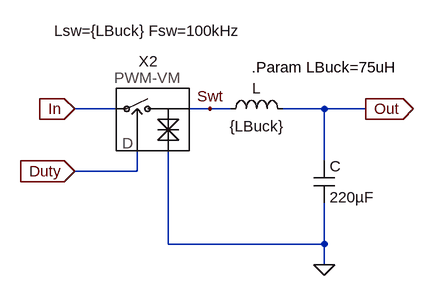
[diagram p0: schematic Buck-VM-Power_Train.asc]
Buck-VM-Power_Train.asc, the LTspice schematic file:
Version 4
SHEET 1 880 696
WIRE 80 48 16 48
WIRE 224 48 192 48
WIRE 256 48 224 48
WIRE 400 48 336 48
WIRE 464 48 400 48
WIRE 400 128 400 48
WIRE 112 144 112 112
WIRE 112 144 16 144
WIRE 160 256 160 112
WIRE 400 256 400 192
WIRE 400 256 160 256
WIRE 400 288 400 256
FLAG 400 288 0
FLAG 16 48 In
IOPIN 16 48 In
FLAG 464 48 Out
IOPIN 464 48 Out
FLAG 224 48 Swt
FLAG 16 144 Duty
IOPIN 16 144 In
SYMBOL ind 240 64 R270
WINDOW 0 32 56 VTop 2
WINDOW 3 5 56 VBottom 2
SYMATTR InstName L
SYMATTR Value {LBuck}
SYMBOL cap 384 128 R0
SYMATTR InstName C
SYMATTR Value 220µF
SYMATTR SpiceLine Rser=70m
SYMBOL PWM-VM 128 64 R0
WINDOW 39 0 -112 Invisible 2
SYMATTR InstName X2
SYMATTR SpiceLine2 Lsw={LBuck} Fsw=100kHz
TEXT 288 -16 Left 2 !.Param LBuck=75uH

The netlist it stands for:
* Buck-VM-Power_Train.asc
L Swt Out {LBuck}
C Out 0 220µF Rser=70m
XX2 In Swt 0 Duty PWM-VM params: DCMin=0.05 DCMax=0.95 Lsw={LBuck} Fsw=100kHz  ; pins nA nC nP nD
.Param LBuck=75uH
.backanno
.end